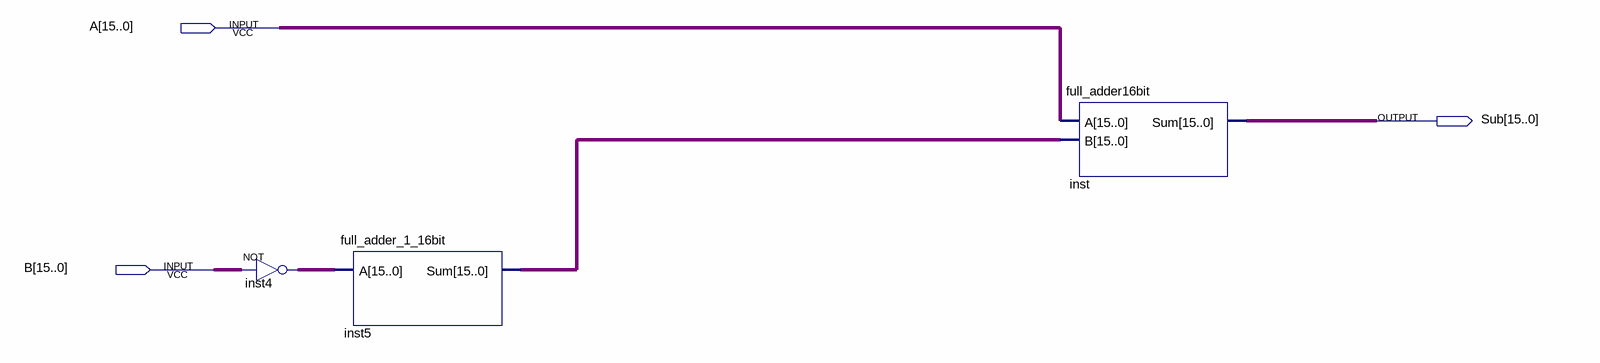
[diagram p0: schematic sheet]
// Quartus schematic Subtractor_compliment_2.bdf as structural Verilog: 3 symbols, 3 pins
module Subtractor_compliment_2 (
  input  [15:0] A,
  input  [15:0] B,
  output [15:0] Sub
);

  wire [15:0] inst4_out, inst5_sum;

  assign inst4_out = ~B;  // NOT inst4, 16 bits wide
  full_adder_1_16bit inst5 (.A(inst4_out), .Sum(inst5_sum));
  full_adder16bit inst (.A(A), .B(inst5_sum), .Sum(Sub));
endmodule
